# Altium schematic sheet 05_03_Buf_and_Not_Gates.SchDoc
size 111 x 66 mm
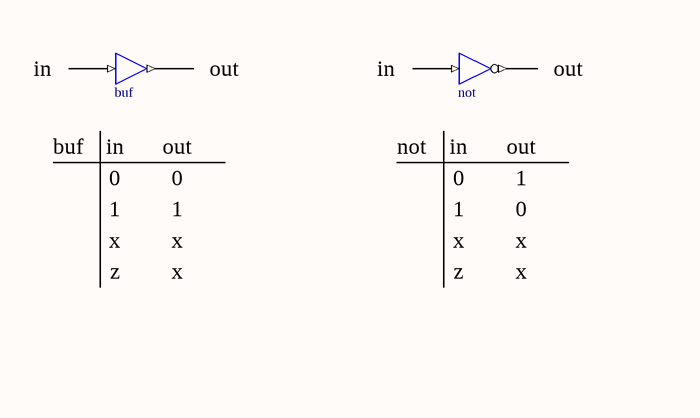
[diagram p0: 05_03_Buf_and_Not_Gates.SchDoc]

## Parts
U15  buf
U16  not

## Nets

Not connected (* = marked no-connect by the designer): U15 I O; U16 I O

## Notes on the sheet
- in
- out
- buf
- 0
- 1
- not
- x
- z

## Library data of the parts
U15 U16 = BUF: 1-bit General Purpose (Non-inverting) Buffer